# Altium schematic sheet Memory.SchDoc: SDRAM
size A4; Date: 9/24/2014; Author: P.A.; CompanyName: STMicroelectronics; Organization: Microcontrollers Division; Address1: 12, Rue Jules HOROWITZ; Address2: 38019 Grenoble; Address3: FRANCE; DocumentNumber: MB1189; Revision: B-07; SheetNumber: 8; SheetTotal: 12; Project: STM32F469I-DISCO
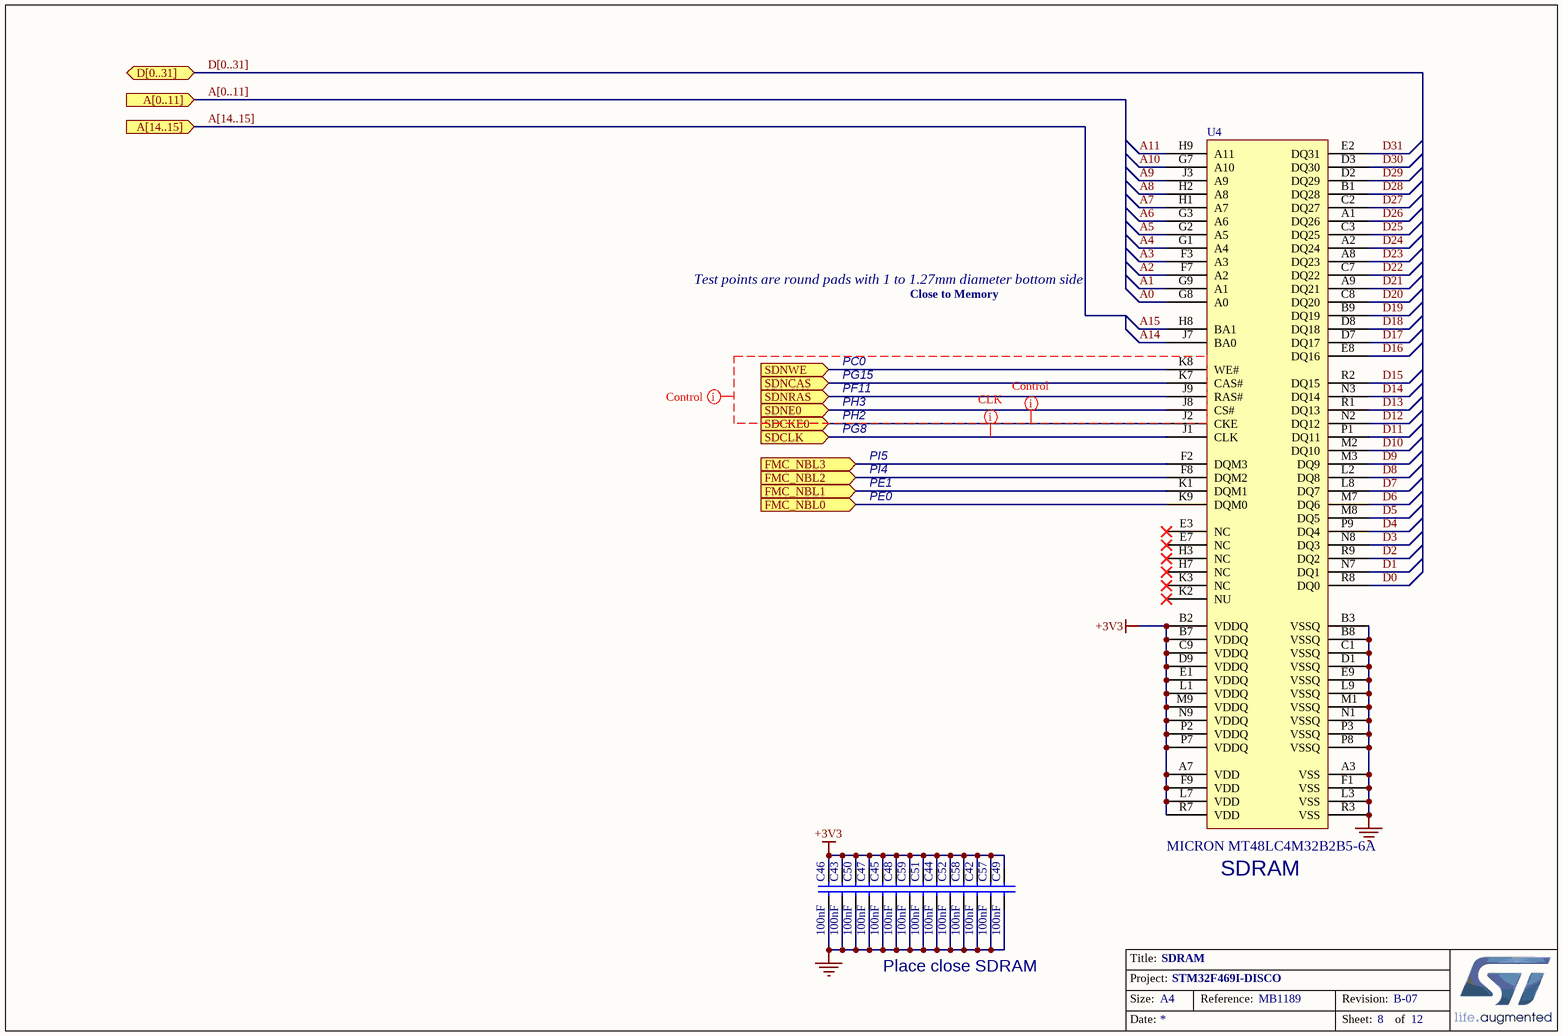
[diagram p0: Memory.SchDoc]

## Parts
C42  100nF  [CAP - 0402]
C43  100nF  [CAP - 0402]
C44  100nF  [CAP - 0402]
C45  100nF  [CAP - 0402]
C46  100nF  [CAP - 0402]
C47  100nF  [CAP - 0402]
C48  100nF  [CAP - 0402]
C49  100nF  [CAP - 0402]
C50  100nF  [CAP - 0402]
C51  100nF  [CAP - 0402]
C52  100nF  [CAP - 0402]
C57  100nF  [CAP - 0402]
C58  100nF  [CAP - 0402]
C59  100nF  [CAP - 0402]
U4  MICRON MT48LC4M32B2B5-6A  [MICT-B5-90]

## Ports
A[0..11] (in), A[14..15] (in), D[0..31] (bidir), FMC_NBL0 (in), FMC_NBL1 (in), FMC_NBL2 (in), FMC_NBL3 (in), SDCKE0 (in), SDCLK (in), SDNCAS (in), SDNE0 (in), SDNRAS (in), SDNWE (in)

## Nets
+3V3: C42.1 C43.1 C44.1 C45.1 C46.1 C47.1 C48.1 C49.1 C50.1 C51.1 C52.1 C57.1 C58.1 C59.1 U4.A7(VDD) U4.B2(VDDQ) U4.B7(VDDQ) U4.C9(VDDQ) U4.D9(VDDQ) U4.E1(VDDQ) U4.F9(VDD) U4.L1(VDDQ) U4.L7(VDD) U4.M9(VDDQ) U4.N9(VDDQ) U4.P2(VDDQ) U4.P7(VDDQ) U4.R7(VDD)
GND: C42.2 C43.2 C44.2 C45.2 C46.2 C47.2 C48.2 C49.2 C50.2 C51.2 C52.2 C57.2 C58.2 C59.2 U4.A3(VSS) U4.B3(VSSQ) U4.B8(VSSQ) U4.C1(VSSQ) U4.D1(VSSQ) U4.E9(VSSQ) U4.F1(VSS) U4.L3(VSS) U4.L9(VSSQ) U4.M1(VSSQ) U4.N1(VSSQ) U4.P3(VSSQ) U4.P8(VSSQ) U4.R3(VSS)
A0: U4.G8(A0)
A1: U4.G9(A1)
A2: U4.F7(A2)
A3: U4.F3(A3)
A4: U4.G1(A4)
A5: U4.G2(A5)
A6: U4.G3(A6)
A7: U4.H1(A7)
A8: U4.H2(A8)
A9: U4.J3(A9)
A10: U4.G7(A10)
A11: U4.H9(A11)
A14: U4.J7(BA0)
A15: U4.H8(BA1)
D0: U4.R8(DQ0)
D1: U4.N7(DQ1)
D2: U4.R9(DQ2)
D3: U4.N8(DQ3)
D4: U4.P9(DQ4)
D5: U4.M8(DQ5)
D6: U4.M7(DQ6)
D7: U4.L8(DQ7)
D8: U4.L2(DQ8)
D9: U4.M3(DQ9)
D10: U4.M2(DQ10)
D11: U4.P1(DQ11)
D12: U4.N2(DQ12)
D13: U4.R1(DQ13)
D14: U4.N3(DQ14)
D15: U4.R2(DQ15)
D16: U4.E8(DQ16)
D17: U4.D7(DQ17)
D18: U4.D8(DQ18)
D19: U4.B9(DQ19)
D20: U4.C8(DQ20)
D21: U4.A9(DQ21)
D22: U4.C7(DQ22)
D23: U4.A8(DQ23)
D24: U4.A2(DQ24)
D25: U4.C3(DQ25)
D26: U4.A1(DQ26)
D27: U4.C2(DQ27)
D28: U4.B1(DQ28)
D29: U4.D2(DQ29)
D30: U4.D3(DQ30)
D31: U4.E2(DQ31)
FMC_NBL0: U4.K9(DQM0) ; port FMC_NBL0
FMC_NBL1: U4.K1(DQM1) ; port FMC_NBL1
FMC_NBL2: U4.F8(DQM2) ; port FMC_NBL2
FMC_NBL3: U4.F2(DQM3) ; port FMC_NBL3
SDCKE0: U4.J2(CKE) ; port SDCKE0
SDCLK: U4.J1(CLK) ; port SDCLK
SDNCAS: U4.K7(CAS#) ; port SDNCAS
SDNE0: U4.J8(CS#) ; port SDNE0
SDNRAS: U4.J9(RAS#) ; port SDNRAS
SDNWE: U4.K8(WE#) ; port SDNWE

Not connected (* = marked no-connect by the designer): U4 E3(NC)* E7(NC)* H3(NC)* H7(NC)* K2(NU)* K3(NC)*

## Buses and harness runs
bus A[0..11] = port A[0..11]
bus A[14..15] = port A[14..15]
bus D[0..31] = port D[0..31]

## Layout directives
net class Control: (no net found under the mark), SDCKE0
net class CLK: SDCLK

## Notes on the sheet
- (near U4) Test points are round pads with 1 to 1.27mm diameter bottom side
- Close to Memory
- PC0
- PG15
- PF11
- PH3
- PH2
- PG8
- PE1
- PE0
- PI5
- PI4
- (near U4) SDRAM
- Place close SDRAM
- Title:
- Project:
- Size:
- Date:
- A4
- Reference:
- Sheet:
- Revision:
- of

## Library data of the parts
C42-C52 C57-C59 = Cap: Capacitor; Value: 10nF; Ordered by: Subcon; Published: 8-Jun-2000; Revision: July-2002: Re-released for DXP Platform.; Publisher: Altium Limited
U4 = MT48LC4M32B2B5: Ordered by: Subcon; ECCN_US/EU: EAR99/NEC; Manuf_1: MICRON; Manuf_Part_1: MT48LC4M32B2B5-6A